# Altium schematic sheet power.SchDoc
size A4
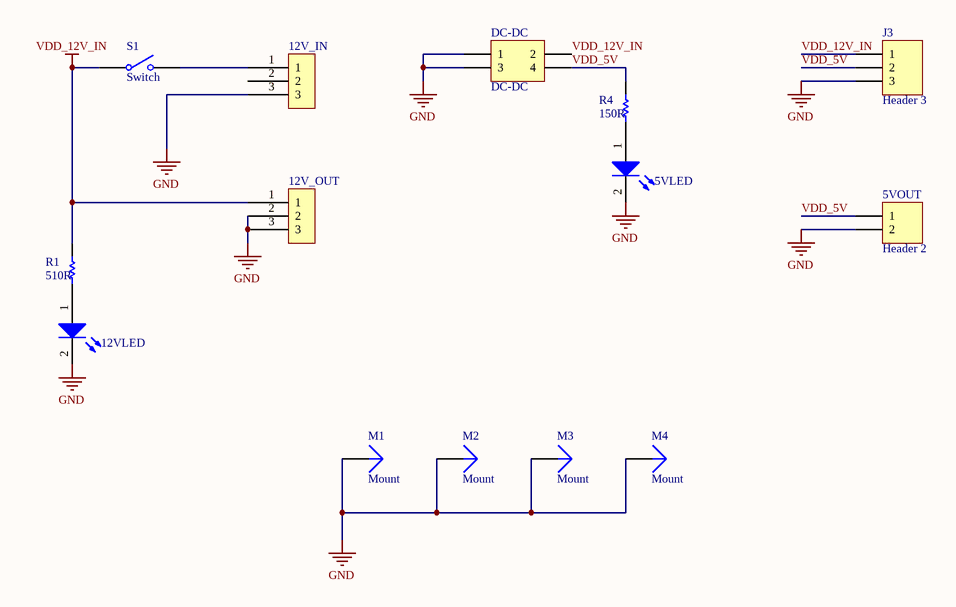
[diagram p0: power.SchDoc]

## Parts
5VLED  5V LED  [0805D]  (value not drawn)
5VOUT  Header 2  [HDR1X2]
12V_IN  12V IN  [PW_PORT]  (value not drawn)
12V_OUT  12V OUT  [PW_PORT]  (value not drawn)
12VLED  12V LED  [0805D]  (value not drawn)
DC-DC  DC-DC  [DC-DC5V_HDR2*2]
J3  Header 3  [HDR1X3]
M1  Mount  [安装孔-3.5-5]
M2  Mount  [安装孔-3.5-5]
M3  Mount  [安装孔-3.5-5]
M4  Mount  [安装孔-3.5-5]
R1  510R  [0805R]
R4  150R  [0805R]
S1  Switch  [PW_KCD2115]

## Nets
GND: 5VLED.2(K) 5VOUT.2 12V_IN.3 12V_OUT.2 12V_OUT.3 12VLED.2(K) DC-DC.1 DC-DC.3 J3.3 M1.1 M2.1 M3.1 M4.1
VDD_12V_IN: 12V_OUT.1 DC-DC.2 J3.1 R1.2 S1.1(COMMON)
VDD_5V: 5VOUT.1 DC-DC.4 J3.2 R4.2
Net5VLED_1: 5VLED.1(A) R4.1
Net12V_IN_1: 12V_IN.1 S1.2(NO)
Net12VLED_1: 12VLED.1(A) R1.1

Not connected (* = marked no-connect by the designer): 12V_IN 2

## Library data of the parts
5VLED 12VLED = LED2: RED; Manufacturer: Generic Components; Class: Optoelectronic; Published: 08/06/2000; Publisher: Altium Hobart Technology Centre; SubClass: LED
5VOUT = Header 2: Header, 2-Pin; LatestRevisionDate: 17-Jul-2002; LatestRevisionNote: Re-released for DXP Platform.; Publisher: Altium Limited
12V_IN 12V_OUT = CON3
DC-DC = Header 2X2: Header, 2-Pin, Dual row; LatestRevisionDate: 17-Jul-2002; LatestRevisionNote: Re-released for DXP Platform.; Publisher: Altium Limited
J3 = Header 3: Header, 3-Pin; LatestRevisionDate: 17-Jul-2002; LatestRevisionNote: Re-released for DXP Platform.; Publisher: Altium Limited
M1-M4 = Plug: LatestRevisionDate: 17-Jul-2002; LatestRevisionNote: Re-released for DXP Platform.; Publisher: Altium Limited
R1 R4 = Res1: Resistor; Manufacturer: Generic Components; Class: Passive; Published: 08/06/2000; Publisher: Altium Hobart Technology Centre; SubClass: Resistor
  R1: Value: 510R
  R4: Value: 150R
S1 = SW-SPST: Single-Pole, Single-Throw Switch; Published: 24-Mar-1999; LatestRevisionDate: 17-Jul-2002; LatestRevisionNote: Re-released for DXP Platform.; PackageReference: SPST-2; Publisher: Altium Limited; PackageDescription: Switch; 2 Leads